# Altium project DM3390_R0M0E0.PrjPcb (part 5 of 5)

## Sheet DM3390_EEPROM.SchDoc: =project_title
size Tabloid; PageSetup: Record=PageOptions|CenterHorizontal=True|CenterVertical=True|PrintScale=0.73|XCorrection=1.00|YCorrection=1.00|PrintKind=0|BorderSize=5000000|LeftOffset=0|BottomOffset=0|Orientation=2|PaperLength=1000|PaperWidth=1000|Scale=100|PaperSource=7|PrintQuality=-4|MediaType=1|DitherType=10|PaperKind=A4|PrintScaleMode=1; CompanyName: Luxonis Holding; DrawnBy: David Malovrh; Organization: Luxonis Holding; Address1: 1925 Harmony Park Drive; Address2: Westminster, CO; Address3: 80234; Address4: United States; DocumentNumber: D0000190; SheetNumber: 10; SheetTotal: 11
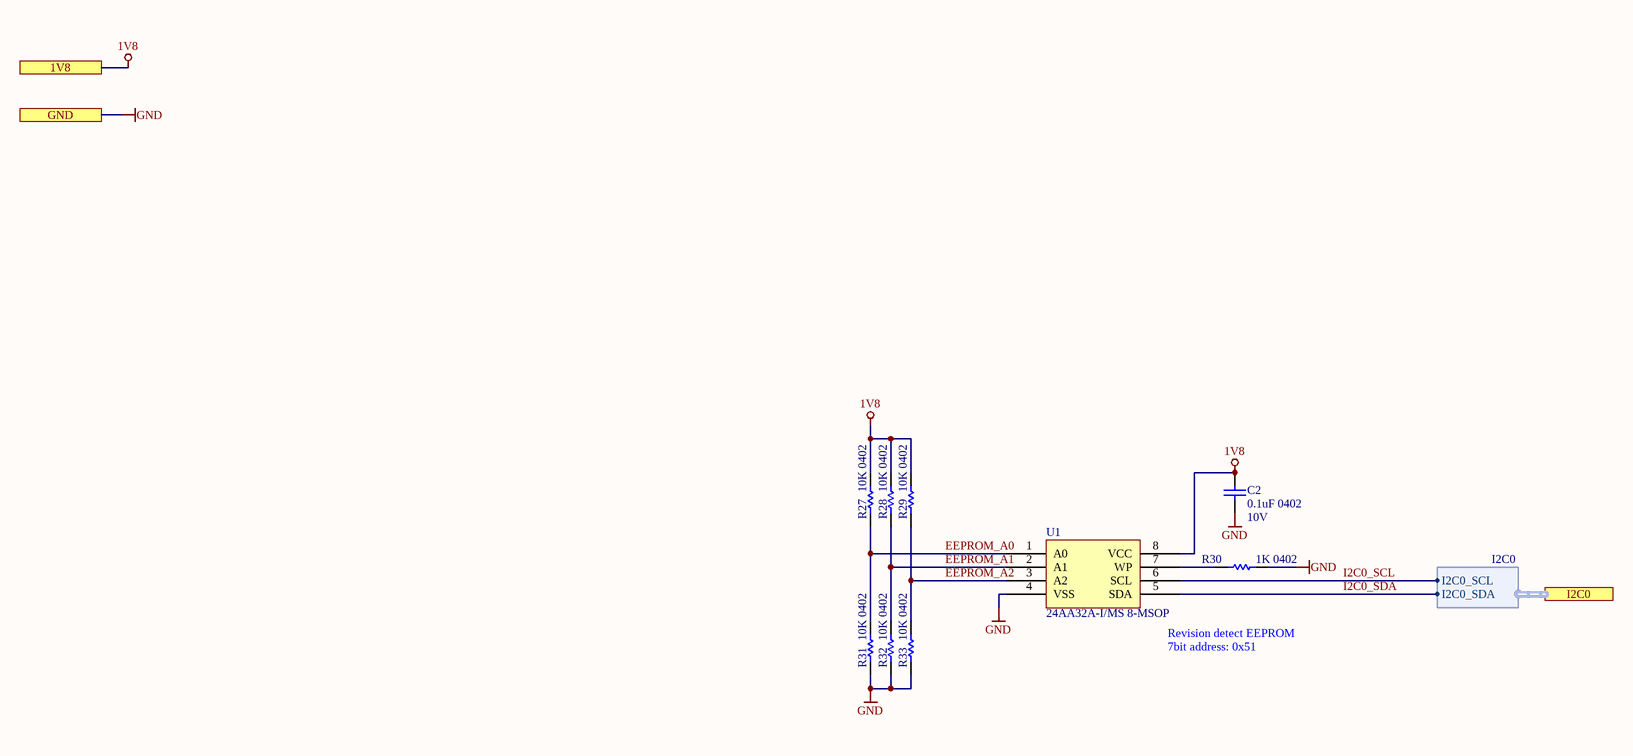
[diagram p10: DM3390_EEPROM.SchDoc]

### Parts
C2  0.1uF 0402  Voltage Rating: 10V  [CAPC0402(1005)70_L]
R27  10K 0402  [RESC0402(1005)_L]
R28  10K 0402  [RESC0402(1005)_L]
R29  10K 0402  [RESC0402(1005)_L]
R30  1K 0402  [RESC0402(1005)_L]
R31  10K 0402  [RESC0402(1005)_L]
R32  10K 0402  [RESC0402(1005)_L]
R33  10K 0402  [RESC0402(1005)_L]
U1  24AA32A-I/MS 8-MSOP  [24AA32A-I/MS]

### Ports
1V8, GND, I2C0 (harness I2C0)

### Harnesses
I2C0: I2C0_SCL, I2C0_SDA

### Nets
1V8: C2.2 R27.2 R28.2 R29.2 U1.8(VCC) ; port 1V8
GND: C2.1 R30.1 R31.1 R32.1 R33.1 U1.4(VSS) ; port GND
EEPROM_A0: R27.1 R31.2 U1.1(A0)
EEPROM_A1: R28.1 R32.2 U1.2(A1)
EEPROM_A2: R29.1 R33.2 U1.3(A2)
I2C0_SCL: U1.6(SCL) ; port I2C0.I2C0_SCL
I2C0_SDA: U1.5(SDA) ; port I2C0.I2C0_SDA
NetR30_2: R30.2 U1.7(WP)

### Notes on the sheet
- (near U1) Revision detect EEPROM
- (near U1) 7bit address: 0x51
- Title
- Size:
- Date:
- Tabloid
- Number:
- Time:
- Revision:
- Sheet
- of
- Drawn by:

### Library data of the parts
C2 = GRM155R71A104JA01D: CAP CER 0.1UF 10V X7R 0402 5%; Manufacturer 1: Murata; Capacitance: 100nF; Supplier 1: Digi-Key; Manufacturer Part Number 1: GRM155R71A104JA01D; Stock 1: 1346709; Pricing 1: 1=0.10000, 10=0.02500, 100=0.01130, 500=0.00806, 1000=0.00633, 2500=0.00575, 5000=0.00529 (USD); RoHS: Yes; Mount: Surface Mount; Case/Package: 0402; Case Code (Imperial): 0402; Case Code (Metric): 1005; Min Operating Temperature: -55°C; Max Operating Temperature: 125°C; Tolerance: 5%; Packaging: Tape and Reel; Voltage Rating (DC): 10V; Dielectric: X7R; Package Quantity: 10000; Termination: SMD/SMT; Length: 1mm; Height: 0.5mm; Width: 0.02inch; Thickness: 0.022inch; Depth: 0.5mm; Radiation Hardening: No; Lead Free: Lead Free; ComponentLink1URL: https://datasheet.ciiva.com/5411/product-5411135.pdf?src-supplier=Mouser; ComponentLink1Description: https://datasheet.ciiva.com/5411/product-5411135.pdf?src-supplier=Mouser; ComponentLink2URL: https://datasheet.ciiva.com/11618/c02e-11618821.pdf?src-supplier=Avnet; ComponentLink2Description: https://datasheet.ciiva.com/11618/c02e-11618821.pdf?src-supplier=Avnet; Supplier Part Number 1: 490-10777-1-ND
R27-R29 R31-R33 = RC0402FR-1310KL: RES SMD 10K OHM 1% 0402 1/16W Chip Resistor, 0402 [1005 Metric], 10 kohm, RC Series, 50 V, Thick Film, 62.5 mW; Manufacturer 1: Yageo; Resistance: 10kR; Temperature Coefficient: 100ppm/°C; Power Rating: 62.5mW; Voltage Rating: 50V; ComponentLink1URL: https://datasheet.ciiva.com/16940/pyu-rc0402-51-rohs-l-6-16940293.pdf?src-supplier=Avnet+Europe; ComponentLink1Description: https://datasheet.ciiva.com/16940/pyu-rc0402-51-rohs-l-6-16940293.pdf?src-supplier=Avnet+Europe; ComponentLink2URL: https://datasheet.ciiva.com/28386/pyu-rc0402-51-rohs-l-6-28386855.pdf?src-supplier=Avnet+Europe; ComponentLink2Description: https://datasheet.ciiva.com/28386/pyu-rc0402-51-rohs-l-6-28386855.pdf?src-supplier=Avnet+Europe; ComponentLink3URL: https://datasheet.ciiva.com/16740/pyu-rc0402-51-rohs-l-6-r-16740602.pdf?src-supplier=Future+Electronics; ComponentLink3Description: https://datasheet.ciiva.com/16740/pyu-rc0402-51-rohs-l-6-r-16740602.pdf?src-supplier=Future+Electronics; ComponentLink4URL: https://datasheet.ciiva.com/8891/pyu-rc0402-51-rohs-l-6-8891339.pdf?src-supplier=Avnet; ComponentLink4Description: https://datasheet.ciiva.com/8891/pyu-rc0402-51-rohs-l-6-8891339.pdf?src-supplier=Avnet; ComponentLink5URL: https://datasheet.ciiva.com/5557/pyu-rc0402-51-rohs-l-6-r-5557997.pdf?src-supplier=Mouser; ComponentLink5Description: https://datasheet.ciiva.com/5557/pyu-rc0402-51-rohs-l-6-r-5557997.pdf?src-supplier=Mouser; ComponentLink6URL: https://datasheet.ciiva.com/7983/1018594-7983533.pdf?src-supplier=Element14; ComponentLink6Description: https://datasheet.ciiva.com/7983/1018594-7983533.pdf?src-supplier=Element14; Supplier 1: Newark; Manufacturer Part Number 1: RC0402FR-1310KL; Stock 1: 62239; Pricing 1: 1=0.10000, 25=0.01200, 100=0.00400, 250=0.00400, 500=0.00300, 1000=0.00300 (USD); RoHS: Yes; Case/Package: 0402; Number of Pins: 2; Contact Plating: Tin,Matte,Lead; Case Code (Imperial): 0402; Case Code (Metric): 1005; Min Operating Temperature: -55°C; Max Operating Temperature: 155°C; Tolerance: 1%; Composition: Thick Film; Packaging: Tape and Reel; Termination: SMD/SMT; Military Standard: Not; Voltage Rating (DC): 50V; Working Voltage: 50V; Number of Terminations: 2; Length: 1mm; Depth: 0.5mm; Radiation Hardening: No; REACH SVHC: No SVHC; Lead Free: Lead Free; Supplier Part Number 1: 67R9960; Supplier 2: Future Electronics; Supplier 3: Mouser; Supplier 4: Element14; Supplier Part Number 2: RC0402FR-1310KL-CUTT; Supplier Part Number 3: 603-RC0402FR-1310KL; Supplier Part Number 4: 1799235
R30 = RC0402FR-071KL: RES SMD 1K OHM 1% 1/16W 0402; Manufacturer 1: Yageo; Temperature Coefficient: 100ppm/°C; Power Rating: 62.5mW; Voltage Rating (DC): 50V; Resistance: 1kR; RoHS: Yes; Number of Pins: 2; Case Code (Imperial): 0402; Case Code (Metric): 1005; Min Operating Temperature: -55°C; Max Operating Temperature: 155°C; Packaging: Tape and Reel; Composition: Thick Film; Voltage Rating: 50V; Military Standard: Not; Termination: SMD/SMT; Length: 1mm; Height: 0.32mm; Width: 0.5mm; Depth: 0.5mm; Lead Free: Lead Free; REACH SVHC: Unknown; ComponentLink1URL: https://datasheet.ciiva.com/11819/0900766b80c66297-11819477.pdf?src-supplier=RSComponents; ComponentLink1Description: https://datasheet.ciiva.com/11819/0900766b80c66297-11819477.pdf?src-supplier=RSComponents; ComponentLink2URL: https://datasheet.ciiva.com/12666/pyu-rc0402-51-rohs-l-6-r-12666741.pdf?src-supplier=Mouser; ComponentLink2Description: https://datasheet.ciiva.com/12666/pyu-rc0402-51-rohs-l-6-r-12666741.pdf?src-supplier=Mouser; ComponentLink3URL: https://datasheet.ciiva.com/17063/pyu-rc0402-51-rohs-l-6-r-17063193.pdf?src-supplier=Future+Electronics; ComponentLink3Description: https://datasheet.ciiva.com/17063/pyu-rc0402-51-rohs-l-6-r-17063193.pdf?src-supplier=Future+Electronics; ComponentLink4URL: https://datasheet.ciiva.com/22747/1018594-22747513.pdf?src-supplier=Element14; ComponentLink4Description: https://datasheet.ciiva.com/22747/1018594-22747513.pdf?src-supplier=Element14; ComponentLink5URL: https://datasheet.ciiva.com/7849/1018594-7849869.pdf?src-supplier=Element14; ComponentLink5Description: https://datasheet.ciiva.com/7849/1018594-7849869.pdf?src-supplier=Element14; ComponentLink6URL: https://datasheet.ciiva.com/7983/1018594-7983502.pdf?src-supplier=Element14; ComponentLink6Description: https://datasheet.ciiva.com/7983/1018594-7983502.pdf?src-supplier=Element14; ComponentLink7URL: https://datasheet.ciiva.com/7849/1018594-7849871.pdf?src-supplier=Element14; ComponentLink7Description: https://datasheet.ciiva.com/7849/1018594-7849871.pdf?src-supplier=Element14; Supplier 1: Digi-Key; Manufacturer Part Number 1: RC0402FR-071KL; Stock 1: 60695854; Pricing 1: 1=0.10000, 10=0.01600, 100=0.00670, 1000=0.00301, 2500=0.00261, 5000=0.00215 (USD); Case/Package: 0402; Tolerance: 1%; Supplier Part Number 1: 311-1.00KLRCT-ND
U1 = 24AA32A-I/MS: IC EEPROM 32K I2C 400KHZ 8MSOP Memory IC 32Kb (4K x 8) I²C 400kHz 900ns 8-MSOP; Manufacturer 1: Microchip; Interface: I2C,Serial,2-Wire; Access Time: 3500ns; Max Supply Voltage: 5.5V; Min Supply Voltage: 1.7V; Nominal Supply Current: 3mA; Supplier 1: Digi-Key; Stock 1: 4213; Pricing 1: 1=0.39000, 25=0.38120, 100=0.36050 (USD); RoHS: Yes; Mount: Surface Mount; Case/Package: MSOP; Number of Pins: 8; Contact Plating: Tin,Matte; Min Operating Temperature: -40°C; Max Operating Temperature: 85°C; Max Frequency: 400kHz; Frequency: 400kHz; Packaging: Rail/Tube; Density: 32Kb; Memory Size: 32Kb; Package Quantity: 100; Length: 3mm; Height: 0.85mm; Width: 3mm; Radiation Hardening: No; Lead Free: Lead Free; REACH SVHC: No SVHC; ComponentLink1URL: https://datasheet.ciiva.com/16309/filehandler-aspxddocname-en011853-16309808.pdf?src-supplier=Future+Electronics; ComponentLink1Description: https://datasheet.ciiva.com/16309/filehandler-aspxddocname-en011853-16309808.pdf?src-supplier=Future+Electronics; ComponentLink2URL: https://datasheet.ciiva.com/16621/21713l-16621382.pdf?src-supplier=Avnet+Europe; ComponentLink2Description: https://datasheet.ciiva.com/16621/21713l-16621382.pdf?src-supplier=Avnet+Europe; ComponentLink3URL: https://datasheet.ciiva.com/3185/21713l-3185209.pdf?src-supplier=Avnet; ComponentLink3Description: https://datasheet.ciiva.com/3185/21713l-3185209.pdf?src-supplier=Avnet; ComponentLink4URL: https://datasheet.ciiva.com/1154/1688094-1154810.pdf?src-supplier=Element14; ComponentLink4Description: https://datasheet.ciiva.com/1154/1688094-1154810.pdf?src-supplier=Element14; ComponentLink5URL: https://datasheet.ciiva.com/41454/001085239-da-01-en-ic-eeprom-32kbit-24aa32a-i-ms-msop-8-mcp-41454934.pdf?src-supplier=Conrad; ComponentLink5Description: https://datasheet.ciiva.com/41454/001085239-da-01-en-ic-eeprom-32kbit-24aa32a-i-ms-msop-8-mcp-41454934.pdf?src-supplier=Conrad; Supplier Part Number 1: 24AA32A-I/MS-ND; Memory Type: EEPROM; Manufacturer Part Number 1: 24AA32A-I/MS; Supplier 2: Mouser; Supplier 3: Newark; Supplier Part Number 2: 579-24AA32A-I/MS; Supplier Part Number 3: 38AH9658

## Sheet DM3390_Connector_C.SchDoc: =project_title
size Tabloid; CompanyName: Luxonis Holding; DrawnBy: David Malovrh; Organization: Luxonis Holding; Address1: 1925 Harmony Park Drive; Address2: Westminster, CO; Address3: 80234; Address4: United States; DocumentNumber: D0000190; SheetNumber: 9; SheetTotal: 12
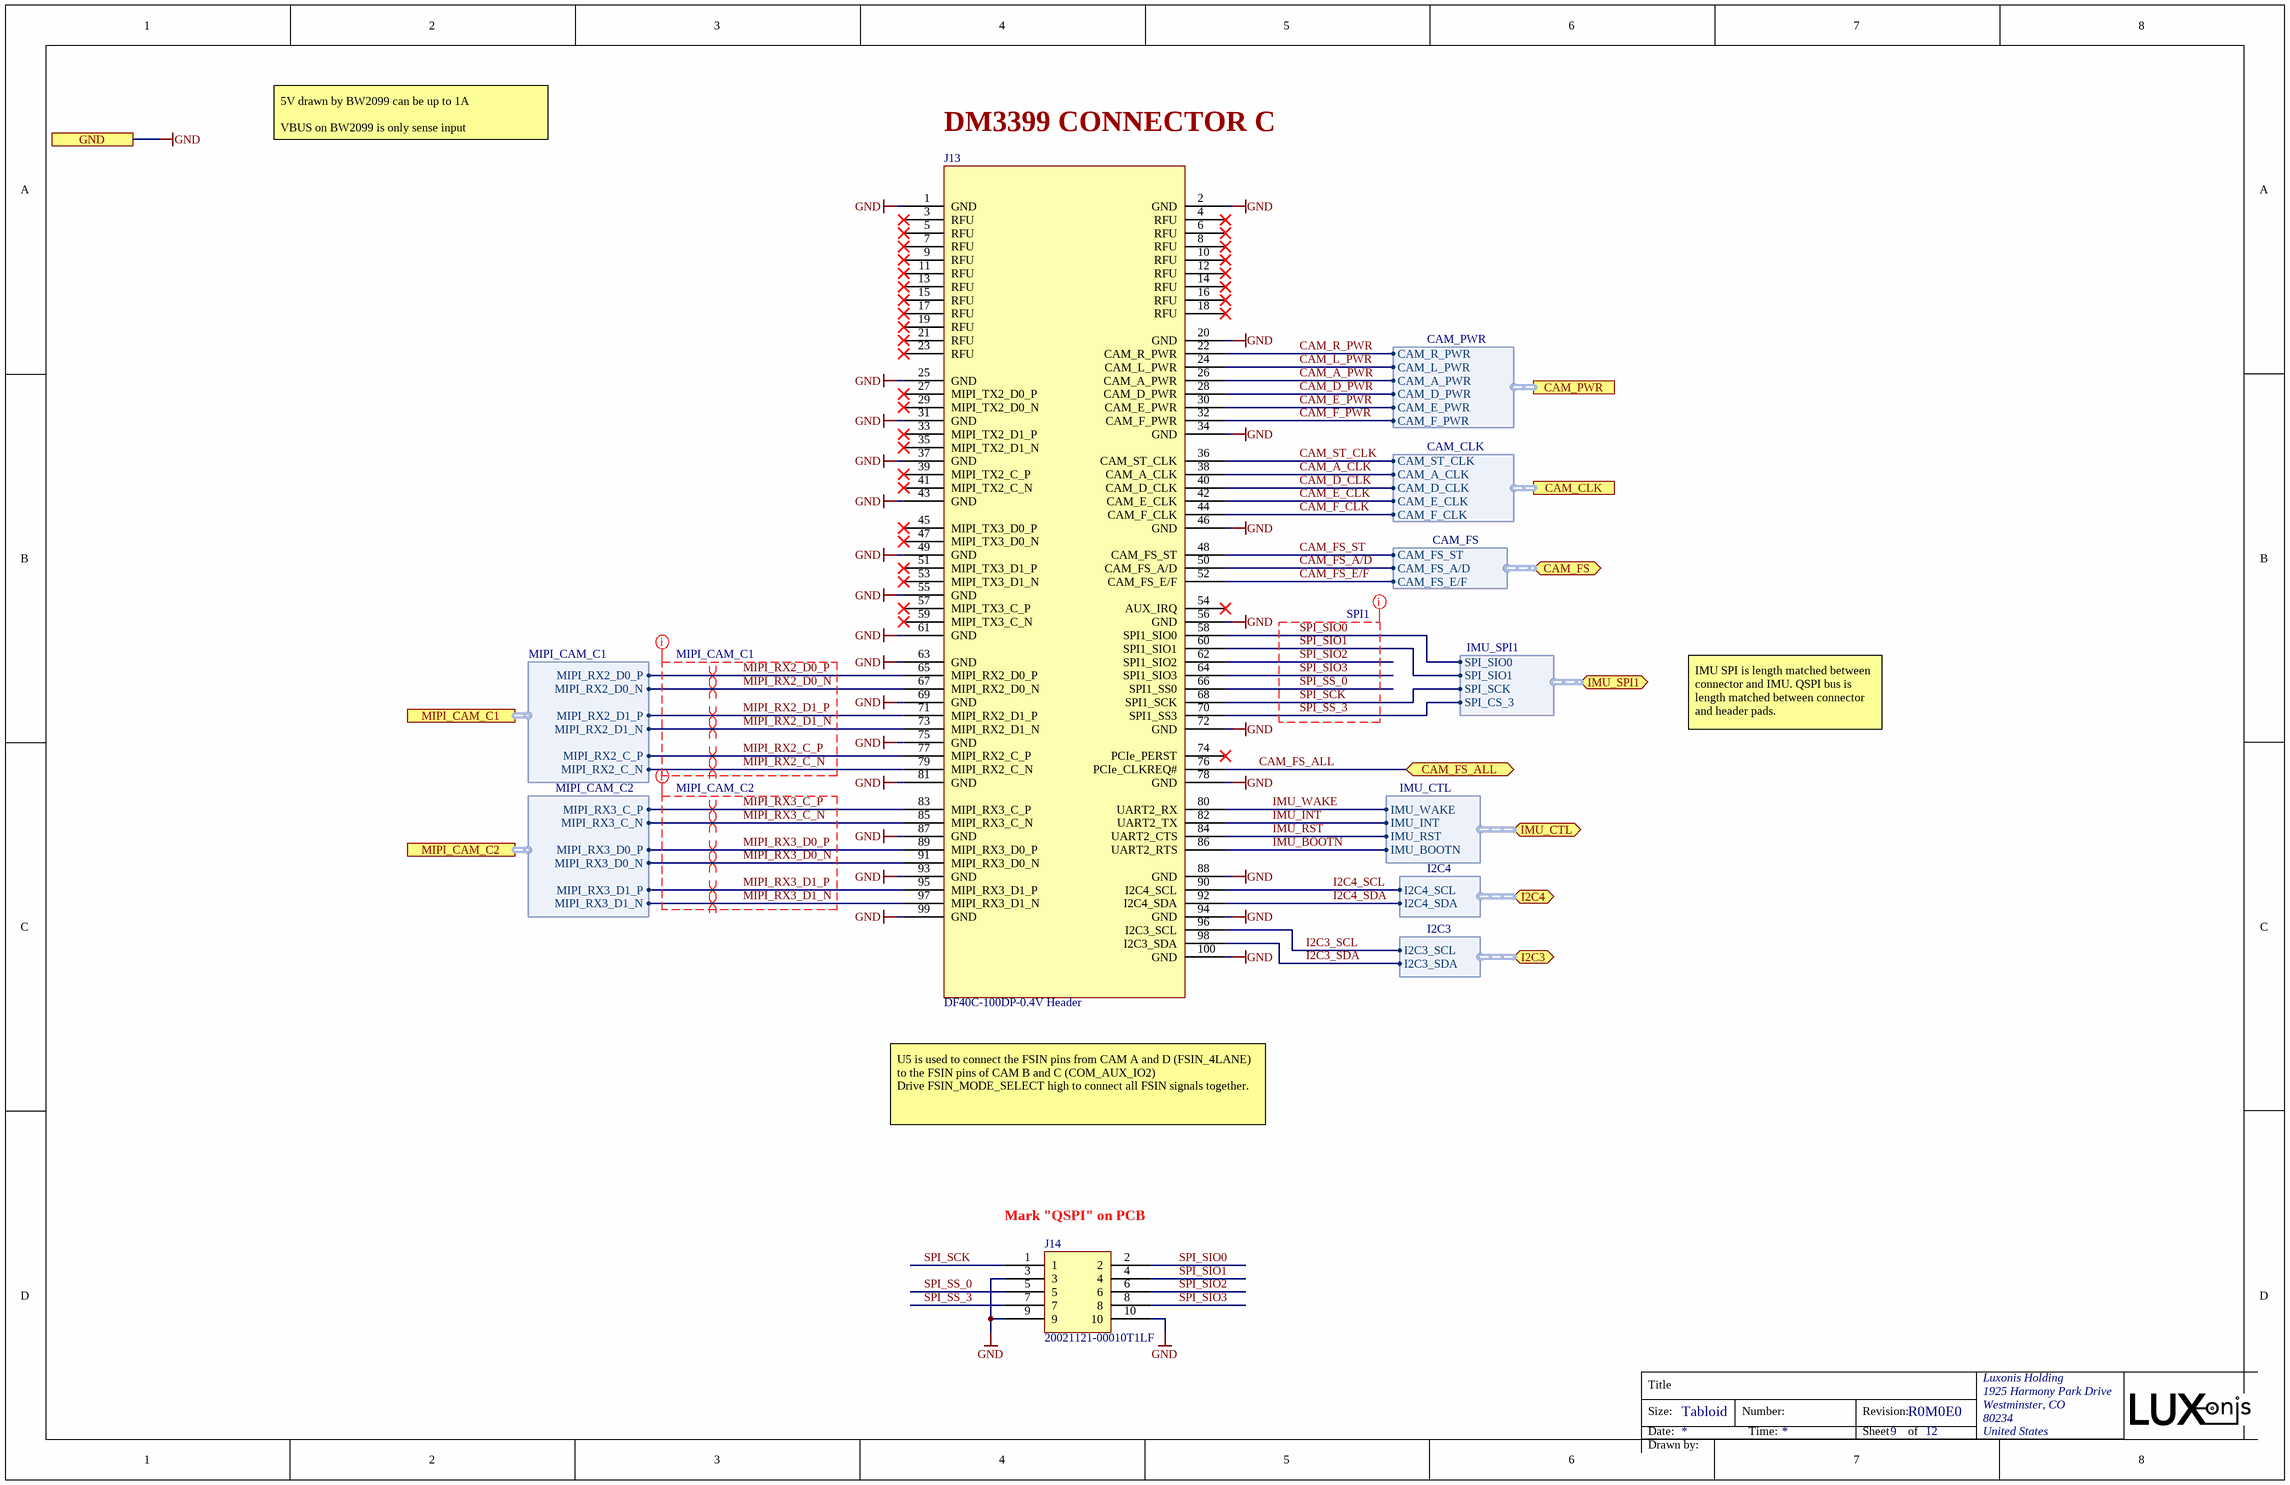
[diagram p11: DM3390_Connector_C.SchDoc]

### Parts
J13  DF40C-100DP-0.4V Header  [CON_C_SoM-MAX_DF40HC-3.0-100DS-0.4V_minpad]
J14  20021121-00010T1LF  [20021121-00010T1LF]

### Ports
CAM_CLK (harness CAM_CLK), CAM_FS (bidir, harness CAM_FS), CAM_FS_ALL (bidir), CAM_PWR (harness CAM_PWR), GND, I2C3 (bidir, harness I2C3), I2C4 (bidir, harness I2C4), IMU_CTL (bidir, harness IMU_CTL), IMU_SPI1 (bidir, harness IMU_SPI1), MIPI_CAM_C1 (harness MIPI_CAM_C1), MIPI_CAM_C2 (harness MIPI_CAM_C2)

### Harnesses
MIPI_CAM_C1: MIPI_RX2_D0_P, MIPI_RX2_D0_N, MIPI_RX2_D1_P, MIPI_RX2_D1_N, MIPI_RX2_C_P, MIPI_RX2_C_N
MIPI_CAM_C2: MIPI_RX3_C_P, MIPI_RX3_C_N, MIPI_RX3_D0_N, MIPI_RX3_D0_P, MIPI_RX3_D1_P, MIPI_RX3_D1_N
I2C3: I2C3_SCL, I2C3_SDA
I2C4: I2C4_SCL, I2C4_SDA
IMU_SPI1: SPI_SIO0, SPI_SIO1, SPI_CS_3, SPI_SCK
CAM_PWR: CAM_R_PWR, CAM_L_PWR, CAM_A_PWR, CAM_D_PWR, CAM_E_PWR, CAM_F_PWR
CAM_CLK: CAM_ST_CLK, CAM_A_CLK, CAM_D_CLK, CAM_E_CLK, CAM_F_CLK
CAM_FS: CAM_FS_ST, CAM_FS_A/D, CAM_FS_E/F
IMU_CTL: IMU_WAKE, IMU_INT, IMU_RST, IMU_BOOTN

### Nets
GND: J13.1(GND) J13.2(GND) J13.20(GND) J13.25(GND) J13.31(GND) J13.34(GND) J13.37(GND) J13.43(GND) J13.46(GND) J13.49(GND) J13.55(GND) J13.56(GND) J13.61(GND) J13.63(GND) J13.69(GND) J13.72(GND) J13.75(GND) J13.78(GND) J13.81(GND) J13.87(GND) J13.88(GND) J13.93(GND) J13.94(GND) J13.99(GND) J13.100(GND) J14.3 J14.9 J14.10 ; port GND
CAM_A_CLK: J13.38(CAM_A_CLK) ; port CAM_CLK.CAM_A_CLK
CAM_A_PWR: J13.26(CAM_A_PWR) ; port CAM_PWR.CAM_A_PWR
CAM_D_CLK: J13.40(CAM_D_CLK) ; port CAM_CLK.CAM_D_CLK
CAM_D_PWR: J13.28(CAM_D_PWR) ; port CAM_PWR.CAM_D_PWR
CAM_E_CLK: J13.42(CAM_E_CLK) ; port CAM_CLK.CAM_E_CLK
CAM_E_PWR: J13.30(CAM_E_PWR) ; port CAM_PWR.CAM_E_PWR
CAM_F_CLK: J13.44(CAM_F_CLK) ; port CAM_CLK.CAM_F_CLK
CAM_F_PWR: J13.32(CAM_F_PWR) ; port CAM_PWR.CAM_F_PWR
CAM_FS_A/D: J13.50(CAM_FS_A/D) ; port CAM_FS.CAM_FS_A/D
CAM_FS_ALL: J13.76(PCIe_CLKREQ#) ; port CAM_FS_ALL
CAM_FS_E/F: J13.52(CAM_FS_E/F) ; port CAM_FS.CAM_FS_E/F
CAM_FS_ST: J13.48(CAM_FS_ST) ; port CAM_FS.CAM_FS_ST
CAM_L_PWR: J13.24(CAM_L_PWR) ; port CAM_PWR.CAM_L_PWR
CAM_R_PWR: J13.22(CAM_R_PWR) ; port CAM_PWR.CAM_R_PWR
CAM_ST_CLK: J13.36(CAM_ST_CLK) ; port CAM_CLK.CAM_ST_CLK
I2C3_SCL: J13.96(I2C3_SCL) ; port I2C3.I2C3_SCL
I2C3_SDA: J13.98(I2C3_SDA) ; port I2C3.I2C3_SDA
I2C4_SCL: J13.90(I2C4_SCL) ; port I2C4.I2C4_SCL
I2C4_SDA: J13.92(I2C4_SDA) ; port I2C4.I2C4_SDA
IMU_BOOTN: J13.86(UART2_RTS) ; port IMU_CTL.IMU_BOOTN
IMU_INT: J13.82(UART2_TX) ; port IMU_CTL.IMU_INT
IMU_RST: J13.84(UART2_CTS) ; port IMU_CTL.IMU_RST
IMU_WAKE: J13.80(UART2_RX) ; port IMU_CTL.IMU_WAKE
MIPI_RX2_C_N: J13.79(MIPI_RX2_C_N) ; port MIPI_CAM_C1.MIPI_RX2_C_N
MIPI_RX2_C_P: J13.77(MIPI_RX2_C_P) ; port MIPI_CAM_C1.MIPI_RX2_C_P
MIPI_RX2_D0_N: J13.67(MIPI_RX2_D0_N) ; port MIPI_CAM_C1.MIPI_RX2_D0_N
MIPI_RX2_D0_P: J13.65(MIPI_RX2_D0_P) ; port MIPI_CAM_C1.MIPI_RX2_D0_P
MIPI_RX2_D1_N: J13.73(MIPI_RX2_D1_N) ; port MIPI_CAM_C1.MIPI_RX2_D1_N
MIPI_RX2_D1_P: J13.71(MIPI_RX2_D1_P) ; port MIPI_CAM_C1.MIPI_RX2_D1_P
MIPI_RX3_C_N: J13.85(MIPI_RX3_C_N) ; port MIPI_CAM_C2.MIPI_RX3_C_N
MIPI_RX3_C_P: J13.83(MIPI_RX3_C_P) ; port MIPI_CAM_C2.MIPI_RX3_C_P
MIPI_RX3_D0_N: J13.91(MIPI_RX3_D0_N) ; port MIPI_CAM_C2.MIPI_RX3_D0_N
MIPI_RX3_D0_P: J13.89(MIPI_RX3_D0_P) ; port MIPI_CAM_C2.MIPI_RX3_D0_P
MIPI_RX3_D1_N: J13.97(MIPI_RX3_D1_N) ; port MIPI_CAM_C2.MIPI_RX3_D1_N
MIPI_RX3_D1_P: J13.95(MIPI_RX3_D1_P) ; port MIPI_CAM_C2.MIPI_RX3_D1_P
SPI_SCK: J13.68(SPI1_SCK) J14.1 ; port IMU_SPI1.SPI_SCK  [project net BNO08x_SCK_1V8]
SPI_SIO0: J13.58(SPI1_SIO0) J14.2 ; port IMU_SPI1.SPI_SIO0  [project net BNO08x_COPI_1V8]
SPI_SIO1: J13.60(SPI1_SIO1) J14.4 ; port IMU_SPI1.SPI_SIO1  [project net BNO08x_CIPO_1V8]
SPI_SIO2: J13.62(SPI1_SIO2) J14.6
SPI_SIO3: J13.64(SPI1_SIO3) J14.8
SPI_SS_0: J13.66(SPI1_SS0) J14.5
SPI_SS_3: J13.70(SPI1_SS3) J14.7 ; port IMU_SPI1.SPI_CS_3  [project net BNO08x_CS_1V8]

Not connected (* = marked no-connect by the designer): J13 3(RFU)* 4(RFU)* 5(RFU)* 6(RFU)* 7(RFU)* 8(RFU)* 9(RFU)* 10(RFU)* 11(RFU)* 12(RFU)* 13(RFU)* 14(RFU)* 15(RFU)* 16(RFU)* 17(RFU)* 18(RFU)* 19(RFU)* 21(RFU)* 23(RFU)* 27(MIPI_TX2_D0_P)* 29(MIPI_TX2_D0_N)* 33(MIPI_TX2_D1_P)* 35(MIPI_TX2_D1_N)* 39(MIPI_TX2_C_P)* 41(MIPI_TX2_C_N)* 45(MIPI_TX3_D0_P)* 47(MIPI_TX3_D0_N)* 51(MIPI_TX3_D1_P)* 53(MIPI_TX3_D1_N)* 54(AUX_IRQ)* 57(MIPI_TX3_C_P)* 59(MIPI_TX3_C_N)* 74(PCIe_PERST)*

### Layout directives
differential pair; differential pair class 100ohm: MIPI_RX2_C_N, MIPI_RX2_C_P, MIPI_RX2_D0_N, MIPI_RX2_D0_P, MIPI_RX2_D1_N, MIPI_RX2_D1_P, MIPI_RX3_C_N, MIPI_RX3_C_P, MIPI_RX3_D0_N, MIPI_RX3_D0_P, MIPI_RX3_D1_N, MIPI_RX3_D1_P
net class MIPI_CAM_C1; rule Matched Net Lengths [Delay Tolerance = 1ps]; rule Matched Net Lengths [Delay Tolerance = 0,5ps]: MIPI_RX2_C_N, MIPI_RX2_C_P, MIPI_RX2_D0_N, MIPI_RX2_D0_P, MIPI_RX2_D1_N, MIPI_RX2_D1_P
net class MIPI_CAM_C2; rule Matched Net Lengths [Delay Tolerance = 1ps]; rule Matched Net Lengths [Delay Tolerance = 0,5ps]: MIPI_RX3_C_N, MIPI_RX3_C_P, MIPI_RX3_D0_N, MIPI_RX3_D0_P, MIPI_RX3_D1_N, MIPI_RX3_D1_P
net class SPI1: SPI_SCK, SPI_SIO0, SPI_SIO1, SPI_SIO2, SPI_SIO3, SPI_SS_0, SPI_SS_3

### Notes on the sheet
- 5V drawn by BW2099 can be up to 1A
  VBUS on BW2099 is only sense input
- DM3399 CONNECTOR C
- IMU SPI is length matched between connector and IMU. QSPI bus is length matched between connector and header pads.
- U5 is used to connect the FSIN pins from CAM A and D (FSIN_4LANE) to the FSIN pins of CAM B and C (COM_AUX_IO2)
  Drive FSIN_MODE_SELECT high to connect all FSIN signals together.
- (near J14) Mark "QSPI" on PCB
- Title
- Size:
- Date:
- Tabloid
- Number:
- Time:
- Revision:
- Sheet
- of
- Drawn by:

### Library data of the parts
J13 = DF40HC(3.0)-100DS-0.4V_OAK-SoM-MAX_C: CONN HDR 100POS 0.4MM SMD GOLD BW2099 SYMBOL; Manufacturer Part Number 1: DF40C-100DP-0.4V(51); mfg: Hirose; mated_height: 1.5mm; pin_current: 0.3A; Number of Contacts: 100; Voltage Rating: 30V; Current Rating: 300mA; Connector Type: Plug; Contact Resistance: 90mR; Gender: Male; Mated Stacking Heights: 4mm; pin_pitch: 0.4mm; mating_connector: DF40C-100DP-0.4V; mfg_pn: DF40C-100DP-0.4V; Supplier 1: Digi-Key; Manufacturer 1: Hirose; Stock 1: 10165; Pricing 1: 1=1.66000, 10=1.50900, 25=1.41680, 50=1.35520, 100=1.29360, 250=1.17040, 500=1.07800, 1000=0.92400 (USD); RoHS: Yes; Mount: Surface Mount; Contact Plating: Gold; Contact Material: Bronze; Housing Color: Black; Housing Material: Polymer; Min Operating Temperature: -35°C; Max Operating Temperature: 85°C; Number of Rows: 2; Termination: SMD/SMT; Package Quantity: 1; Packaging: Tape and Reel; Number of Positions: 100; Orientation: Straight; Max Current Rating: 300mA; Max Voltage Rating (AC): 30V; Length: 21.52mm; Pitch: 0.4mm; Depth: 1.85mm; Stack Height: 1.5mm; Radiation Hardening: No; REACH SVHC: Unknown; Lead Free: Lead Free; ComponentLink1URL: https://datasheet.ciiva.com/26948/getdatasheetpartid-434445-26948932.pdf?src-supplier=Verical; ComponentLink1Description: https://datasheet.ciiva.com/26948/getdatasheetpartid-434445-26948932.pdf?src-supplier=Verical; ComponentLink2URL: https://datasheet.ciiva.com/46408/1824826-46408893.pdf?src-supplier=Element14; ComponentLink2Description: https://datasheet.ciiva.com/46408/1824826-46408893.pdf?src-supplier=Element14; ComponentLink3URL: http://datasheet.octopart.com/DF40C-100DP-0.4V%2851%29-Hirose-datasheet-12512482.pdf?src-supplier=Newark; ComponentLink3Description: http://datasheet.octopart.com/DF40C-100DP-0.4V%2851%29-Hirose-datasheet-12512482.pdf?src-supplier=Newark; ComponentLink4URL: http://datasheet.octopart.com/DF40C-100DP-0.4V%2851%29-Hirose-datasheet-24967586.pdf?src-supplier=Element14; ComponentLink4Description: http://datasheet.octopart.com/DF40C-100DP-0.4V%2851%29-Hirose-datasheet-24967586.pdf?src-supplier=Element14; ComponentLink5URL: http://datasheet.octopart.com/DF40C-100DP-0.4V%2851%29-Hirose-datasheet-8329537.pdf?src-supplier=Factory+Futures; ComponentLink5Description: http://datasheet.octopart.com/DF40C-100DP-0.4V%2851%29-Hirose-datasheet-8329537.pdf?src-supplier=Factory+Futures; ComponentLink6URL: http://datasheet.octopart.com/DF40C-100DP-0.4V%2851%29-Hirose-datasheet-62290554.pdf?src-supplier=Future+Electronics; ComponentLink6Description: http://datasheet.octopart.com/DF40C-100DP-0.4V%2851%29-Hirose-datasheet-62290554.pdf?src-supplier=Future+Electronics; ComponentLink7URL: http://datasheet.octopart.com/DF40C-100DP-0.4V%2851%29-Hirose-datasheet-130255728.pdf?src-supplier=Future+Electronics; ComponentLink7Description: http://datasheet.octopart.com/DF40C-100DP-0.4V%2851%29-Hirose-datasheet-130255728.pdf?src-supplier=Future+Electronics; Supplier Part Number 1: H11614CT-ND; Supplier 2: Mouser; Supplier Part Number 2: 798-DF40C100DP0.4V51
J14 = 20021121-00010T1LF: CONN HEADER SMD 10POS 1.27MM; Manufacturer 1: Amphenol FCI; Number of Contacts: 10; Contact Resistance: 30mR; Max Voltage Rating (AC): 125V; Connector Type: Male Pin; Row Spacing: 0.05inch; Supplier 1: Digi-Key; Manufacturer Part Number 1: 20021121-00010T1LF; Stock 1: 1465; Pricing 1: 1=0.77000, 10=0.71800, 100=0.55040, 500=0.47860, 1000=0.39485, 5000=0.34699, 10000=0.32306 (USD); RoHS: Yes; Mount: Surface Mount; Contact Plating: Gold; Color: Black; Contact Material: Copper Alloy; Housing Color: Black; Housing Material: Thermoplastic; Min Operating Temperature: -40°C; Max Operating Temperature: 85°C; Number of Rows: 2; Termination: Solder; Package Quantity: 93; Packaging: Rail/Tube; Number of Positions: 10; Orientation: Straight; Length: 6.35mm; Pitch: 1.27mm; Contact Mating Length: 0.12inch; Depth: 3.4mm; ComponentLink1URL: https://datasheet.ciiva.com/18659/20021121-18659066.pdf?src-supplier=Digi-Key; ComponentLink1Description: https://datasheet.ciiva.com/18659/20021121-18659066.pdf?src-supplier=Digi-Key; ComponentLink2URL: https://datasheet.ciiva.com/10033/20021121-10033582.pdf?src-supplier=Avnet; ComponentLink2Description: https://datasheet.ciiva.com/10033/20021121-10033582.pdf?src-supplier=Avnet; Supplier Part Number 1: 609-6529-ND; Supplier 2: Mouser; Supplier 3: TTI; Supplier Part Number 2: 649-200211210010T1LF; Supplier Part Number 3: 20021121-00010T1LF

## Nets that join several sheets
1V8: DM3390_USB (7 pins), DM3390_Power_Supply (C23.2 TP16.1 U7.5), DM3390_IMU (9 pins), DM3390_BOOT_JTAG_SD (10 pins), DM3390_EEPROM (5 pins)
3V3: DM3390_USB (7 pins), DM3390_Power_Supply (8 pins), DM3390_IMU (5 pins), DM3390_BOOT_JTAG_SD (C1.2 J8.9 J9.4), DM3390_CAM_FFC_MIPI_2LANE (12 pins)
5V: DM3390_USB (6 pins), DM3390_Power_Supply (17 pins), DM3390_CAM_FFC_MIPI_2LANE (J7.1), DM3390_Connector_A (13 pins), DM3390_Connector_B (R25.2 R26.2)
GND: DM3390_TopLevel (MTG1.1 MTG2.1 MTG3.1 MTG4.1), DM3390_USB (33 pins), DM3390_Power_Supply (25 pins), DM3390_IMU (14 pins), DM3390_BOOT_JTAG_SD (17 pins), DM3390_CAM_FFC_ESD_AUX (24 pins), DM3390_CAM_FFC_MIPI_2LANE (57 pins), DM3390_Connector_A (35 pins), DM3390_Connector_B (33 pins), DM3390_EEPROM (6 pins), DM3390_Connector_C (28 pins)
VBUS: DM3390_USB (9 pins), DM3390_Power_Supply (7 pins), DM3390_Connector_B (J11.30)
BNO08x_CIPO_1V8: DM3390_IMU (U2.20 U3.1), DM3390_Connector_C (J13.60 J14.4)
BNO08x_COPI_1V8: DM3390_IMU (U2.17 U3.14), DM3390_Connector_C (J13.58 J14.2)
BNO08x_CS_1V8: DM3390_IMU (U2.18 U3.12), DM3390_Connector_C (J13.70 J14.7)
BNO08x_SCK_1V8: DM3390_IMU (U2.19 U3.13), DM3390_Connector_C (J13.68 J14.1)
BOOT0: DM3390_BOOT_JTAG_SD (R14.1 R23.1), DM3390_Connector_B (J11.52)
BOOT1: DM3390_BOOT_JTAG_SD (R13.1 R22.1), DM3390_Connector_B (J11.50)
BOOT2: DM3390_BOOT_JTAG_SD (R12.1 R21.1), DM3390_Connector_B (J11.48)
BOOT3: DM3390_BOOT_JTAG_SD (R11.1 R20.1), DM3390_Connector_B (J11.46)
BOOT4: DM3390_BOOT_JTAG_SD (R10.1 R19.1), DM3390_Connector_B (J11.44)
BOOT5: DM3390_BOOT_JTAG_SD (R9.1 R18.1), DM3390_Connector_B (J11.42)
BOOT6: DM3390_BOOT_JTAG_SD (R8.1 R17.1), DM3390_Connector_B (J11.40)
BOOT7: DM3390_BOOT_JTAG_SD (R7.1 R15.1 R16.1), DM3390_Connector_B (J11.38)
BOOT_SEL: DM3390_BOOT_JTAG_SD (B1.2 R15.2 TP7.1), DM3390_CAM_FFC_MIPI_2LANE (J7.4), DM3390_Connector_B (J12.7)
CAM_A_CLK: DM3390_CAM_FFC_ESD_AUX (D2.1 D2.10), DM3390_CAM_FFC_MIPI_2LANE (J1.18), DM3390_Connector_C (J13.38)
CAM_A_PWR: DM3390_CAM_FFC_ESD_AUX (D2.2 D2.9), DM3390_CAM_FFC_MIPI_2LANE (J1.17), DM3390_Connector_C (J13.26)
CAM_D_CLK: DM3390_CAM_FFC_ESD_AUX (D8.1 D8.10), DM3390_CAM_FFC_MIPI_2LANE (J5.18), DM3390_Connector_C (J13.40)
CAM_D_PWR: DM3390_CAM_FFC_ESD_AUX (D8.2 D8.9), DM3390_CAM_FFC_MIPI_2LANE (J5.17), DM3390_Connector_C (J13.28)
CAM_E_CLK: DM3390_CAM_FFC_ESD_AUX (D3.1 D3.10), DM3390_CAM_FFC_MIPI_2LANE (J2.18), DM3390_Connector_C (J13.42)
CAM_E_PWR: DM3390_CAM_FFC_ESD_AUX (D3.2 D3.9), DM3390_CAM_FFC_MIPI_2LANE (J2.17), DM3390_Connector_C (J13.30)
CAM_F_CLK: DM3390_CAM_FFC_ESD_AUX (D9.1 D9.10), DM3390_CAM_FFC_MIPI_2LANE (J6.18), DM3390_Connector_C (J13.44)
CAM_F_PWR: DM3390_CAM_FFC_ESD_AUX (D9.2 D9.9), DM3390_CAM_FFC_MIPI_2LANE (J6.17), DM3390_Connector_C (J13.32)
CAM_FS_A/D: DM3390_CAM_FFC_MIPI_2LANE (R2.2 R59.1 R63.1), DM3390_Connector_C (J13.50)
CAM_FS_ALL: DM3390_CAM_FFC_MIPI_2LANE (R1.1 R2.1 R3.1 R4.1), DM3390_Connector_B (J12.3), DM3390_Connector_C (J13.76)
CAM_FS_E/F: DM3390_CAM_FFC_MIPI_2LANE (R4.2 R60.1 R64.1), DM3390_Connector_C (J13.52)
CAM_FS_ST: DM3390_CAM_FFC_MIPI_2LANE (J7.6 R1.2 R61.1 R62.1), DM3390_Connector_C (J13.48)
CAM_L_PWR: DM3390_CAM_FFC_ESD_AUX (D1.2 D1.9), DM3390_CAM_FFC_MIPI_2LANE (J3.17), DM3390_Connector_C (J13.24)
CAM_R_PWR: DM3390_CAM_FFC_ESD_AUX (D7.2 D7.9), DM3390_CAM_FFC_MIPI_2LANE (J4.17), DM3390_Connector_C (J13.22)
CAM_ST_CLK: DM3390_CAM_FFC_ESD_AUX (D1.1 D1.10 D7.1 D7.10), DM3390_CAM_FFC_MIPI_2LANE (J3.18 J4.18), DM3390_Connector_C (J13.36)
I2C0_SCL: DM3390_Connector_A (J10.27), DM3390_EEPROM (U1.6)
I2C0_SDA: DM3390_Connector_A (J10.29), DM3390_EEPROM (U1.5)
I2C1_SCL: DM3390_CAM_FFC_MIPI_2LANE (J1.20 J5.20), DM3390_Connector_B (J11.39)
I2C1_SDA: DM3390_CAM_FFC_MIPI_2LANE (J1.21 J5.21), DM3390_Connector_B (J11.41)
I2C2_SCL: DM3390_CAM_FFC_MIPI_2LANE (J3.20 J4.20), DM3390_Connector_A (J10.98)
I2C2_SDA: DM3390_CAM_FFC_MIPI_2LANE (J3.21 J4.21), DM3390_Connector_A (J10.100)
I2C3_SCL: DM3390_CAM_FFC_MIPI_2LANE (J2.20 J6.20), DM3390_Connector_C (J13.96)
I2C3_SDA: DM3390_CAM_FFC_MIPI_2LANE (J2.21 J6.21), DM3390_Connector_C (J13.98)
I2C4_SCL: DM3390_Connector_B (J12.2), DM3390_Connector_C (J13.90)
I2C4_SDA: DM3390_Connector_B (J12.4), DM3390_Connector_C (J13.92)
IMU_BOOTN: DM3390_IMU (R34.1 TP8.1 U2.4), DM3390_Connector_C (J13.86)
IMU_INT: DM3390_IMU (TP10.1 U2.14 U3.4), DM3390_Connector_C (J13.82)
IMU_RST: DM3390_IMU (TP9.1 U2.11), DM3390_Connector_C (J13.84)
IMU_WAKE: DM3390_IMU (TP11.1 U2.6 U3.9), DM3390_Connector_C (J13.80)
KB_PG: DM3390_Power_Supply (U6.9), DM3390_Connector_A (J10.36 M1.1), DM3390_Connector_B (J12.5)
KB_USB_CM: DM3390_USB (U10.5), DM3390_Connector_B (J11.63)
KB_USB_PORT: DM3390_USB (U10.4), DM3390_Connector_B (J11.65)
MIPI_RX0__C_N: DM3390_CAM_FFC_ESD_AUX (D7.5 D7.6), DM3390_CAM_FFC_MIPI_2LANE (J4.8), DM3390_Connector_B (J11.84)
MIPI_RX0__C_P: DM3390_CAM_FFC_ESD_AUX (D7.4 D7.7), DM3390_CAM_FFC_MIPI_2LANE (J4.9), DM3390_Connector_B (J11.86)
MIPI_RX0__D0_N: DM3390_CAM_FFC_ESD_AUX (D10.5 D10.6), DM3390_CAM_FFC_MIPI_2LANE (J4.2), DM3390_Connector_B (J11.96)
MIPI_RX0__D0_P: DM3390_CAM_FFC_ESD_AUX (D10.4 D10.7), DM3390_CAM_FFC_MIPI_2LANE (J4.3), DM3390_Connector_B (J11.98)
MIPI_RX0__D1_N: DM3390_CAM_FFC_ESD_AUX (D10.2 D10.9), DM3390_CAM_FFC_MIPI_2LANE (J4.5), DM3390_Connector_B (J11.90)
MIPI_RX0__D1_P: DM3390_CAM_FFC_ESD_AUX (D10.1 D10.10), DM3390_CAM_FFC_MIPI_2LANE (J4.6), DM3390_Connector_B (J11.92)
MIPI_RX1_C_N: DM3390_CAM_FFC_ESD_AUX (D8.5 D8.6), DM3390_CAM_FFC_MIPI_2LANE (J5.8), DM3390_Connector_B (J11.72)
MIPI_RX1_C_P: DM3390_CAM_FFC_ESD_AUX (D8.4 D8.7), DM3390_CAM_FFC_MIPI_2LANE (J5.9), DM3390_Connector_B (J11.74)
MIPI_RX1_D0_N: DM3390_CAM_FFC_ESD_AUX (D11.5 D11.6), DM3390_CAM_FFC_MIPI_2LANE (J5.2), DM3390_Connector_B (J11.66)
MIPI_RX1_D0_P: DM3390_CAM_FFC_ESD_AUX (D11.4 D11.7), DM3390_CAM_FFC_MIPI_2LANE (J5.3), DM3390_Connector_B (J11.68)
MIPI_RX1_D1_N: DM3390_CAM_FFC_ESD_AUX (D11.2 D11.9), DM3390_CAM_FFC_MIPI_2LANE (J5.5), DM3390_Connector_B (J11.60)
MIPI_RX1_D1_P: DM3390_CAM_FFC_ESD_AUX (D11.1 D11.10), DM3390_CAM_FFC_MIPI_2LANE (J5.6), DM3390_Connector_B (J11.62)
MIPI_RX2_C_N: DM3390_CAM_FFC_ESD_AUX (D3.5 D3.6), DM3390_CAM_FFC_MIPI_2LANE (J2.8), DM3390_Connector_C (J13.79)
MIPI_RX2_C_P: DM3390_CAM_FFC_ESD_AUX (D3.4 D3.7), DM3390_CAM_FFC_MIPI_2LANE (J2.9), DM3390_Connector_C (J13.77)
MIPI_RX2_D0_N: DM3390_CAM_FFC_ESD_AUX (D6.5 D6.6), DM3390_CAM_FFC_MIPI_2LANE (J2.2), DM3390_Connector_C (J13.67)
MIPI_RX2_D0_P: DM3390_CAM_FFC_ESD_AUX (D6.4 D6.7), DM3390_CAM_FFC_MIPI_2LANE (J2.3), DM3390_Connector_C (J13.65)
MIPI_RX2_D1_N: DM3390_CAM_FFC_ESD_AUX (D6.2 D6.9), DM3390_CAM_FFC_MIPI_2LANE (J2.5), DM3390_Connector_C (J13.73)
MIPI_RX2_D1_P: DM3390_CAM_FFC_ESD_AUX (D6.1 D6.10), DM3390_CAM_FFC_MIPI_2LANE (J2.6), DM3390_Connector_C (J13.71)
MIPI_RX3_C_N: DM3390_CAM_FFC_ESD_AUX (D9.5 D9.6), DM3390_CAM_FFC_MIPI_2LANE (J6.8), DM3390_Connector_C (J13.85)
MIPI_RX3_C_P: DM3390_CAM_FFC_ESD_AUX (D9.4 D9.7), DM3390_CAM_FFC_MIPI_2LANE (J6.9), DM3390_Connector_C (J13.83)
MIPI_RX3_D0_N: DM3390_CAM_FFC_ESD_AUX (D12.5 D12.6), DM3390_CAM_FFC_MIPI_2LANE (J6.2), DM3390_Connector_C (J13.91)
MIPI_RX3_D0_P: DM3390_CAM_FFC_ESD_AUX (D12.4 D12.7), DM3390_CAM_FFC_MIPI_2LANE (J6.3), DM3390_Connector_C (J13.89)
MIPI_RX3_D1_N: DM3390_CAM_FFC_ESD_AUX (D12.2 D12.9), DM3390_CAM_FFC_MIPI_2LANE (J6.5), DM3390_Connector_C (J13.97)
MIPI_RX3_D1_P: DM3390_CAM_FFC_ESD_AUX (D12.1 D12.10), DM3390_CAM_FFC_MIPI_2LANE (J6.6), DM3390_Connector_C (J13.95)
MIPI_RX4_C_N: DM3390_CAM_FFC_ESD_AUX (D1.5 D1.6), DM3390_CAM_FFC_MIPI_2LANE (J3.8), DM3390_Connector_A (J10.47)
MIPI_RX4_C_P: DM3390_CAM_FFC_ESD_AUX (D1.4 D1.7), DM3390_CAM_FFC_MIPI_2LANE (J3.9), DM3390_Connector_A (J10.45)
MIPI_RX4_D0_N: DM3390_CAM_FFC_ESD_AUX (D4.5 D4.6), DM3390_CAM_FFC_MIPI_2LANE (J3.2), DM3390_Connector_A (J10.35)
MIPI_RX4_D0_P: DM3390_CAM_FFC_ESD_AUX (D4.4 D4.7), DM3390_CAM_FFC_MIPI_2LANE (J3.3), DM3390_Connector_A (J10.33)
MIPI_RX4_D1_N: DM3390_CAM_FFC_ESD_AUX (D4.2 D4.9), DM3390_CAM_FFC_MIPI_2LANE (J3.5), DM3390_Connector_A (J10.41)
MIPI_RX4_D1_P: DM3390_CAM_FFC_ESD_AUX (D4.1 D4.10), DM3390_CAM_FFC_MIPI_2LANE (J3.6), DM3390_Connector_A (J10.39)
MIPI_RX5_C_N: DM3390_CAM_FFC_ESD_AUX (D2.5 D2.6), DM3390_CAM_FFC_MIPI_2LANE (J1.8), DM3390_Connector_A (J10.53)
MIPI_RX5_C_P: DM3390_CAM_FFC_ESD_AUX (D2.4 D2.7), DM3390_CAM_FFC_MIPI_2LANE (J1.9), DM3390_Connector_A (J10.51)
MIPI_RX5_D0_N: DM3390_CAM_FFC_ESD_AUX (D5.5 D5.6), DM3390_CAM_FFC_MIPI_2LANE (J1.2), DM3390_Connector_A (J10.59)
MIPI_RX5_D0_P: DM3390_CAM_FFC_ESD_AUX (D5.4 D5.7), DM3390_CAM_FFC_MIPI_2LANE (J1.3), DM3390_Connector_A (J10.57)
MIPI_RX5_D1_N: DM3390_CAM_FFC_ESD_AUX (D5.2 D5.9), DM3390_CAM_FFC_MIPI_2LANE (J1.5), DM3390_Connector_A (J10.65)
MIPI_RX5_D1_P: DM3390_CAM_FFC_ESD_AUX (D5.1 D5.10), DM3390_CAM_FFC_MIPI_2LANE (J1.6), DM3390_Connector_A (J10.63)
SD_HST0_CD: DM3390_BOOT_JTAG_SD (R5.2), DM3390_Connector_A (J10.60)
SD_HST0_CLK: DM3390_BOOT_JTAG_SD (J9.5), DM3390_Connector_A (J10.62)
SD_HST0_CMD: DM3390_BOOT_JTAG_SD (J9.3), DM3390_Connector_A (J10.64)
SD_HST0_D0: DM3390_BOOT_JTAG_SD (J9.7), DM3390_Connector_A (J10.66)
SD_HST0_D1: DM3390_BOOT_JTAG_SD (J9.8), DM3390_Connector_A (J10.68)
SD_HST0_D2: DM3390_BOOT_JTAG_SD (J9.1), DM3390_Connector_A (J10.70)
SD_HST0_D3: DM3390_BOOT_JTAG_SD (J9.2), DM3390_Connector_A (J10.72)
SYS_nRST: DM3390_BOOT_JTAG_SD (J8.6), DM3390_CAM_FFC_MIPI_2LANE (J7.3), DM3390_Connector_A (B2.2 J10.40), DM3390_Connector_B (J12.1)
TCK: DM3390_BOOT_JTAG_SD (J8.2), DM3390_Connector_A (J10.48)
TDI: DM3390_BOOT_JTAG_SD (J8.3), DM3390_Connector_A (J10.46)
TDO: DM3390_BOOT_JTAG_SD (J8.5), DM3390_Connector_A (J10.42)
TMS: DM3390_BOOT_JTAG_SD (J8.1), DM3390_Connector_A (J10.50)
TRST: DM3390_BOOT_JTAG_SD (J8.4), DM3390_Connector_A (J10.44)
USB_D_N: DM3390_USB (D19.1 D19.10 J16.A7 J16.B7), DM3390_Connector_B (J11.12)
USB_D_P: DM3390_USB (D19.2 D19.9 J16.A6 J16.B6), DM3390_Connector_B (J11.10)
USB_OUT1: DM3390_USB (R51.1 U9.7), DM3390_Connector_B (J11.59)
USB_OUT2: DM3390_USB (R52.1 U9.8), DM3390_Connector_B (J11.61)
USB_RX_N: DM3390_USB (U8.7), DM3390_Connector_B (J11.18)
USB_RX_P: DM3390_USB (U8.8), DM3390_Connector_B (J11.16)
USB_TX_N: DM3390_USB (U8.3), DM3390_Connector_B (J11.4)
USB_TX_P: DM3390_USB (U8.4), DM3390_Connector_B (J11.6)
VCONN_Fn: DM3390_USB (R50.1 U9.6), DM3390_Connector_B (J11.69)

## Assembly variants
Production: not fitted C3 C4 C5 C6 C7 C8 C9 R7 R8 R9 R10 R20 R21 R22 R23 R28 R29 R31 R35 R36 R37 R43 R44 R56 U2 Y1